# Altium project LedMatrix.PrjPCB (part 2 of 2)
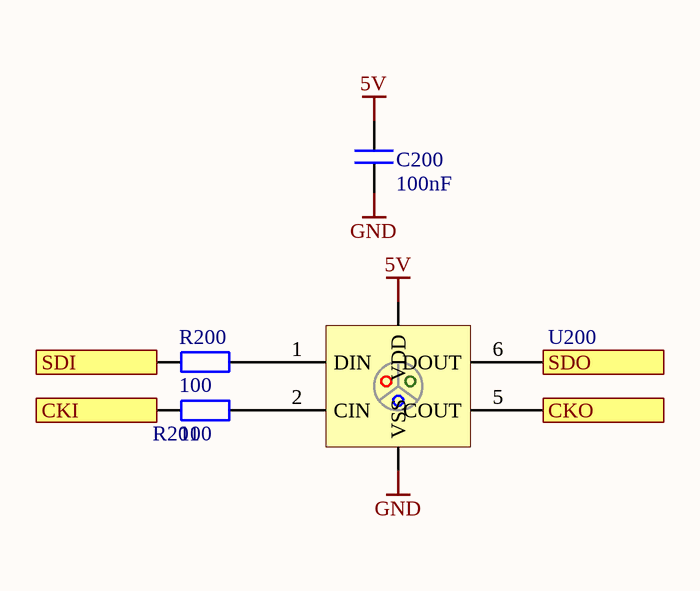
[diagram p3: LedMatrixPixel.SchDoc]

## Nets that join several sheets
5V: LedMatrixMain (5 pins), U_LedMatrixPixelArray/U_LedMatrixPixel (C200_U_LedMatrixPixel49.2 U200_U_LedMatrixPixel49.4), U_LedMatrixPixelArray/U_LedMatrixPixel (C200_U_LedMatrixPixel48.2 U200_U_LedMatrixPixel48.4), U_LedMatrixPixelArray/U_LedMatrixPixel (C200_U_LedMatrixPixel47.2 U200_U_LedMatrixPixel47.4), U_LedMatrixPixelArray/U_LedMatrixPixel (C200_U_LedMatrixPixel46.2 U200_U_LedMatrixPixel46.4), U_LedMatrixPixelArray/U_LedMatrixPixel (C200_U_LedMatrixPixel45.2 U200_U_LedMatrixPixel45.4), U_LedMatrixPixelArray/U_LedMatrixPixel (C200_U_LedMatrixPixel44.2 U200_U_LedMatrixPixel44.4), U_LedMatrixPixelArray/U_LedMatrixPixel (C200_U_LedMatrixPixel43.2 U200_U_LedMatrixPixel43.4), U_LedMatrixPixelArray/U_LedMatrixPixel (C200_U_LedMatrixPixel42.2 U200_U_LedMatrixPixel42.4), U_LedMatrixPixelArray/U_LedMatrixPixel (C200_U_LedMatrixPixel41.2 U200_U_LedMatrixPixel41.4), U_LedMatrixPixelArray/U_LedMatrixPixel (C200_U_LedMatrixPixel40.2 U200_U_LedMatrixPixel40.4), U_LedMatrixPixelArray/U_LedMatrixPixel (C200_U_LedMatrixPixel39.2 U200_U_LedMatrixPixel39.4), U_LedMatrixPixelArray/U_LedMatrixPixel (C200_U_LedMatrixPixel38.2 U200_U_LedMatrixPixel38.4), U_LedMatrixPixelArray/U_LedMatrixPixel (C200_U_LedMatrixPixel37.2 U200_U_LedMatrixPixel37.4), U_LedMatrixPixelArray/U_LedMatrixPixel (C200_U_LedMatrixPixel36.2 U200_U_LedMatrixPixel36.4), U_LedMatrixPixelArray/U_LedMatrixPixel (C200_U_LedMatrixPixel35.2 U200_U_LedMatrixPixel35.4), U_LedMatrixPixelArray/U_LedMatrixPixel (C200_U_LedMatrixPixel34.2 U200_U_LedMatrixPixel34.4), U_LedMatrixPixelArray/U_LedMatrixPixel (C200_U_LedMatrixPixel33.2 U200_U_LedMatrixPixel33.4), U_LedMatrixPixelArray/U_LedMatrixPixel (C200_U_LedMatrixPixel32.2 U200_U_LedMatrixPixel32.4), U_LedMatrixPixelArray/U_LedMatrixPixel (C200_U_LedMatrixPixel31.2 U200_U_LedMatrixPixel31.4), U_LedMatrixPixelArray/U_LedMatrixPixel (C200_U_LedMatrixPixel30.2 U200_U_LedMatrixPixel30.4), U_LedMatrixPixelArray/U_LedMatrixPixel (C200_U_LedMatrixPixel29.2 U200_U_LedMatrixPixel29.4), U_LedMatrixPixelArray/U_LedMatrixPixel (C200_U_LedMatrixPixel28.2 U200_U_LedMatrixPixel28.4), U_LedMatrixPixelArray/U_LedMatrixPixel (C200_U_LedMatrixPixel27.2 U200_U_LedMatrixPixel27.4), U_LedMatrixPixelArray/U_LedMatrixPixel (C200_U_LedMatrixPixel26.2 U200_U_LedMatrixPixel26.4), U_LedMatrixPixelArray/U_LedMatrixPixel (C200_U_LedMatrixPixel25.2 U200_U_LedMatrixPixel25.4), U_LedMatrixPixelArray/U_LedMatrixPixel (C200_U_LedMatrixPixel24.2 U200_U_LedMatrixPixel24.4), U_LedMatrixPixelArray/U_LedMatrixPixel (C200_U_LedMatrixPixel23.2 U200_U_LedMatrixPixel23.4), U_LedMatrixPixelArray/U_LedMatrixPixel (C200_U_LedMatrixPixel22.2 U200_U_LedMatrixPixel22.4), U_LedMatrixPixelArray/U_LedMatrixPixel (C200_U_LedMatrixPixel21.2 U200_U_LedMatrixPixel21.4), U_LedMatrixPixelArray/U_LedMatrixPixel (C200_U_LedMatrixPixel20.2 U200_U_LedMatrixPixel20.4), U_LedMatrixPixelArray/U_LedMatrixPixel (C200_U_LedMatrixPixel19.2 U200_U_LedMatrixPixel19.4), U_LedMatrixPixelArray/U_LedMatrixPixel (C200_U_LedMatrixPixel18.2 U200_U_LedMatrixPixel18.4), U_LedMatrixPixelArray/U_LedMatrixPixel (C200_U_LedMatrixPixel17.2 U200_U_LedMatrixPixel17.4), U_LedMatrixPixelArray/U_LedMatrixPixel (C200_U_LedMatrixPixel16.2 U200_U_LedMatrixPixel16.4), U_LedMatrixPixelArray/U_LedMatrixPixel (C200_U_LedMatrixPixel15.2 U200_U_LedMatrixPixel15.4), U_LedMatrixPixelArray/U_LedMatrixPixel (C200_U_LedMatrixPixel14.2 U200_U_LedMatrixPixel14.4), U_LedMatrixPixelArray/U_LedMatrixPixel (C200_U_LedMatrixPixel13.2 U200_U_LedMatrixPixel13.4), U_LedMatrixPixelArray/U_LedMatrixPixel (C200_U_LedMatrixPixel12.2 U200_U_LedMatrixPixel12.4), U_LedMatrixPixelArray/U_LedMatrixPixel (C200_U_LedMatrixPixel11.2 U200_U_LedMatrixPixel11.4), U_LedMatrixPixelArray/U_LedMatrixPixel (C200_U_LedMatrixPixel10.2 U200_U_LedMatrixPixel10.4), U_LedMatrixPixelArray/U_LedMatrixPixel (C200_U_LedMatrixPixel9.2 U200_U_LedMatrixPixel9.4), U_LedMatrixPixelArray/U_LedMatrixPixel (C200_U_LedMatrixPixel8.2 U200_U_LedMatrixPixel8.4), U_LedMatrixPixelArray/U_LedMatrixPixel (C200_U_LedMatrixPixel7.2 U200_U_LedMatrixPixel7.4), U_LedMatrixPixelArray/U_LedMatrixPixel (C200_U_LedMatrixPixel6.2 U200_U_LedMatrixPixel6.4), U_LedMatrixPixelArray/U_LedMatrixPixel (C200_U_LedMatrixPixel5.2 U200_U_LedMatrixPixel5.4), U_LedMatrixPixelArray/U_LedMatrixPixel (C200_U_LedMatrixPixel4.2 U200_U_LedMatrixPixel4.4), U_LedMatrixPixelArray/U_LedMatrixPixel (C200_U_LedMatrixPixel3.2 U200_U_LedMatrixPixel3.4), U_LedMatrixPixelArray/U_LedMatrixPixel (C200_U_LedMatrixPixel2.2 U200_U_LedMatrixPixel2.4), U_LedMatrixPixelArray/U_LedMatrixPixel (C200_U_LedMatrixPixel1.2 U200_U_LedMatrixPixel1.4)
GND: LedMatrixMain (14 pins), U_LedMatrixPixelArray/U_LedMatrixPixel (C200_U_LedMatrixPixel49.1 U200_U_LedMatrixPixel49.3), U_LedMatrixPixelArray/U_LedMatrixPixel (C200_U_LedMatrixPixel48.1 U200_U_LedMatrixPixel48.3), U_LedMatrixPixelArray/U_LedMatrixPixel (C200_U_LedMatrixPixel47.1 U200_U_LedMatrixPixel47.3), U_LedMatrixPixelArray/U_LedMatrixPixel (C200_U_LedMatrixPixel46.1 U200_U_LedMatrixPixel46.3), U_LedMatrixPixelArray/U_LedMatrixPixel (C200_U_LedMatrixPixel45.1 U200_U_LedMatrixPixel45.3), U_LedMatrixPixelArray/U_LedMatrixPixel (C200_U_LedMatrixPixel44.1 U200_U_LedMatrixPixel44.3), U_LedMatrixPixelArray/U_LedMatrixPixel (C200_U_LedMatrixPixel43.1 U200_U_LedMatrixPixel43.3), U_LedMatrixPixelArray/U_LedMatrixPixel (C200_U_LedMatrixPixel42.1 U200_U_LedMatrixPixel42.3), U_LedMatrixPixelArray/U_LedMatrixPixel (C200_U_LedMatrixPixel41.1 U200_U_LedMatrixPixel41.3), U_LedMatrixPixelArray/U_LedMatrixPixel (C200_U_LedMatrixPixel40.1 U200_U_LedMatrixPixel40.3), U_LedMatrixPixelArray/U_LedMatrixPixel (C200_U_LedMatrixPixel39.1 U200_U_LedMatrixPixel39.3), U_LedMatrixPixelArray/U_LedMatrixPixel (C200_U_LedMatrixPixel38.1 U200_U_LedMatrixPixel38.3), U_LedMatrixPixelArray/U_LedMatrixPixel (C200_U_LedMatrixPixel37.1 U200_U_LedMatrixPixel37.3), U_LedMatrixPixelArray/U_LedMatrixPixel (C200_U_LedMatrixPixel36.1 U200_U_LedMatrixPixel36.3), U_LedMatrixPixelArray/U_LedMatrixPixel (C200_U_LedMatrixPixel35.1 U200_U_LedMatrixPixel35.3), U_LedMatrixPixelArray/U_LedMatrixPixel (C200_U_LedMatrixPixel34.1 U200_U_LedMatrixPixel34.3), U_LedMatrixPixelArray/U_LedMatrixPixel (C200_U_LedMatrixPixel33.1 U200_U_LedMatrixPixel33.3), U_LedMatrixPixelArray/U_LedMatrixPixel (C200_U_LedMatrixPixel32.1 U200_U_LedMatrixPixel32.3), U_LedMatrixPixelArray/U_LedMatrixPixel (C200_U_LedMatrixPixel31.1 U200_U_LedMatrixPixel31.3), U_LedMatrixPixelArray/U_LedMatrixPixel (C200_U_LedMatrixPixel30.1 U200_U_LedMatrixPixel30.3), U_LedMatrixPixelArray/U_LedMatrixPixel (C200_U_LedMatrixPixel29.1 U200_U_LedMatrixPixel29.3), U_LedMatrixPixelArray/U_LedMatrixPixel (C200_U_LedMatrixPixel28.1 U200_U_LedMatrixPixel28.3), U_LedMatrixPixelArray/U_LedMatrixPixel (C200_U_LedMatrixPixel27.1 U200_U_LedMatrixPixel27.3), U_LedMatrixPixelArray/U_LedMatrixPixel (C200_U_LedMatrixPixel26.1 U200_U_LedMatrixPixel26.3), U_LedMatrixPixelArray/U_LedMatrixPixel (C200_U_LedMatrixPixel25.1 U200_U_LedMatrixPixel25.3), U_LedMatrixPixelArray/U_LedMatrixPixel (C200_U_LedMatrixPixel24.1 U200_U_LedMatrixPixel24.3), U_LedMatrixPixelArray/U_LedMatrixPixel (C200_U_LedMatrixPixel23.1 U200_U_LedMatrixPixel23.3), U_LedMatrixPixelArray/U_LedMatrixPixel (C200_U_LedMatrixPixel22.1 U200_U_LedMatrixPixel22.3), U_LedMatrixPixelArray/U_LedMatrixPixel (C200_U_LedMatrixPixel21.1 U200_U_LedMatrixPixel21.3), U_LedMatrixPixelArray/U_LedMatrixPixel (C200_U_LedMatrixPixel20.1 U200_U_LedMatrixPixel20.3), U_LedMatrixPixelArray/U_LedMatrixPixel (C200_U_LedMatrixPixel19.1 U200_U_LedMatrixPixel19.3), U_LedMatrixPixelArray/U_LedMatrixPixel (C200_U_LedMatrixPixel18.1 U200_U_LedMatrixPixel18.3), U_LedMatrixPixelArray/U_LedMatrixPixel (C200_U_LedMatrixPixel17.1 U200_U_LedMatrixPixel17.3), U_LedMatrixPixelArray/U_LedMatrixPixel (C200_U_LedMatrixPixel16.1 U200_U_LedMatrixPixel16.3), U_LedMatrixPixelArray/U_LedMatrixPixel (C200_U_LedMatrixPixel15.1 U200_U_LedMatrixPixel15.3), U_LedMatrixPixelArray/U_LedMatrixPixel (C200_U_LedMatrixPixel14.1 U200_U_LedMatrixPixel14.3), U_LedMatrixPixelArray/U_LedMatrixPixel (C200_U_LedMatrixPixel13.1 U200_U_LedMatrixPixel13.3), U_LedMatrixPixelArray/U_LedMatrixPixel (C200_U_LedMatrixPixel12.1 U200_U_LedMatrixPixel12.3), U_LedMatrixPixelArray/U_LedMatrixPixel (C200_U_LedMatrixPixel11.1 U200_U_LedMatrixPixel11.3), U_LedMatrixPixelArray/U_LedMatrixPixel (C200_U_LedMatrixPixel10.1 U200_U_LedMatrixPixel10.3), U_LedMatrixPixelArray/U_LedMatrixPixel (C200_U_LedMatrixPixel9.1 U200_U_LedMatrixPixel9.3), U_LedMatrixPixelArray/U_LedMatrixPixel (C200_U_LedMatrixPixel8.1 U200_U_LedMatrixPixel8.3), U_LedMatrixPixelArray/U_LedMatrixPixel (C200_U_LedMatrixPixel7.1 U200_U_LedMatrixPixel7.3), U_LedMatrixPixelArray/U_LedMatrixPixel (C200_U_LedMatrixPixel6.1 U200_U_LedMatrixPixel6.3), U_LedMatrixPixelArray/U_LedMatrixPixel (C200_U_LedMatrixPixel5.1 U200_U_LedMatrixPixel5.3), U_LedMatrixPixelArray/U_LedMatrixPixel (C200_U_LedMatrixPixel4.1 U200_U_LedMatrixPixel4.3), U_LedMatrixPixelArray/U_LedMatrixPixel (C200_U_LedMatrixPixel3.1 U200_U_LedMatrixPixel3.3), U_LedMatrixPixelArray/U_LedMatrixPixel (C200_U_LedMatrixPixel2.1 U200_U_LedMatrixPixel2.3), U_LedMatrixPixelArray/U_LedMatrixPixel (C200_U_LedMatrixPixel1.1 U200_U_LedMatrixPixel1.3)
CKO8: U_LedMatrixPixelArray/U_LedMatrixPixel (R201_U_LedMatrixPixel44.1), U_LedMatrixPixelArray/U_LedMatrixPixel (U200_U_LedMatrixPixel1.5)
CKO16: U_LedMatrixPixelArray/U_LedMatrixPixel (R201_U_LedMatrixPixel45.1), U_LedMatrixPixelArray/U_LedMatrixPixel (U200_U_LedMatrixPixel2.5)
CKO24: U_LedMatrixPixelArray/U_LedMatrixPixel (R201_U_LedMatrixPixel46.1), U_LedMatrixPixelArray/U_LedMatrixPixel (U200_U_LedMatrixPixel3.5)
CKO32: U_LedMatrixPixelArray/U_LedMatrixPixel (R201_U_LedMatrixPixel47.1), U_LedMatrixPixelArray/U_LedMatrixPixel (U200_U_LedMatrixPixel4.5)
CKO40: U_LedMatrixPixelArray/U_LedMatrixPixel (R201_U_LedMatrixPixel48.1), U_LedMatrixPixelArray/U_LedMatrixPixel (U200_U_LedMatrixPixel5.5)
CKO48: U_LedMatrixPixelArray/U_LedMatrixPixel (R201_U_LedMatrixPixel49.1), U_LedMatrixPixelArray/U_LedMatrixPixel (U200_U_LedMatrixPixel6.5)
NetR200_U_LedMatrixPixel1_1: U_LedMatrixPixelArray/U_LedMatrixPixel (U200_U_LedMatrixPixel8.6), U_LedMatrixPixelArray/U_LedMatrixPixel (R200_U_LedMatrixPixel1.1)
NetR200_U_LedMatrixPixel2_1: U_LedMatrixPixelArray/U_LedMatrixPixel (U200_U_LedMatrixPixel9.6), U_LedMatrixPixelArray/U_LedMatrixPixel (R200_U_LedMatrixPixel2.1)
NetR200_U_LedMatrixPixel3_1: U_LedMatrixPixelArray/U_LedMatrixPixel (U200_U_LedMatrixPixel10.6), U_LedMatrixPixelArray/U_LedMatrixPixel (R200_U_LedMatrixPixel3.1)
NetR200_U_LedMatrixPixel4_1: U_LedMatrixPixelArray/U_LedMatrixPixel (U200_U_LedMatrixPixel11.6), U_LedMatrixPixelArray/U_LedMatrixPixel (R200_U_LedMatrixPixel4.1)
NetR200_U_LedMatrixPixel5_1: U_LedMatrixPixelArray/U_LedMatrixPixel (U200_U_LedMatrixPixel12.6), U_LedMatrixPixelArray/U_LedMatrixPixel (R200_U_LedMatrixPixel5.1)
NetR200_U_LedMatrixPixel6_1: U_LedMatrixPixelArray/U_LedMatrixPixel (U200_U_LedMatrixPixel13.6), U_LedMatrixPixelArray/U_LedMatrixPixel (R200_U_LedMatrixPixel6.1)
NetR200_U_LedMatrixPixel7_1: U_LedMatrixPixelArray/U_LedMatrixPixel (U200_U_LedMatrixPixel14.6), U_LedMatrixPixelArray/U_LedMatrixPixel (R200_U_LedMatrixPixel7.1)
NetR200_U_LedMatrixPixel8_1: U_LedMatrixPixelArray/U_LedMatrixPixel (U200_U_LedMatrixPixel15.6), U_LedMatrixPixelArray/U_LedMatrixPixel (R200_U_LedMatrixPixel8.1)
NetR200_U_LedMatrixPixel9_1: U_LedMatrixPixelArray/U_LedMatrixPixel (U200_U_LedMatrixPixel16.6), U_LedMatrixPixelArray/U_LedMatrixPixel (R200_U_LedMatrixPixel9.1)
NetR200_U_LedMatrixPixel10_1: U_LedMatrixPixelArray/U_LedMatrixPixel (U200_U_LedMatrixPixel17.6), U_LedMatrixPixelArray/U_LedMatrixPixel (R200_U_LedMatrixPixel10.1)
NetR200_U_LedMatrixPixel11_1: U_LedMatrixPixelArray/U_LedMatrixPixel (U200_U_LedMatrixPixel18.6), U_LedMatrixPixelArray/U_LedMatrixPixel (R200_U_LedMatrixPixel11.1)
NetR200_U_LedMatrixPixel12_1: U_LedMatrixPixelArray/U_LedMatrixPixel (U200_U_LedMatrixPixel19.6), U_LedMatrixPixelArray/U_LedMatrixPixel (R200_U_LedMatrixPixel12.1)
NetR200_U_LedMatrixPixel13_1: U_LedMatrixPixelArray/U_LedMatrixPixel (U200_U_LedMatrixPixel20.6), U_LedMatrixPixelArray/U_LedMatrixPixel (R200_U_LedMatrixPixel13.1)
NetR200_U_LedMatrixPixel14_1: U_LedMatrixPixelArray/U_LedMatrixPixel (U200_U_LedMatrixPixel21.6), U_LedMatrixPixelArray/U_LedMatrixPixel (R200_U_LedMatrixPixel14.1)
NetR200_U_LedMatrixPixel15_1: U_LedMatrixPixelArray/U_LedMatrixPixel (U200_U_LedMatrixPixel22.6), U_LedMatrixPixelArray/U_LedMatrixPixel (R200_U_LedMatrixPixel15.1)
NetR200_U_LedMatrixPixel16_1: U_LedMatrixPixelArray/U_LedMatrixPixel (U200_U_LedMatrixPixel23.6), U_LedMatrixPixelArray/U_LedMatrixPixel (R200_U_LedMatrixPixel16.1)
NetR200_U_LedMatrixPixel17_1: U_LedMatrixPixelArray/U_LedMatrixPixel (U200_U_LedMatrixPixel24.6), U_LedMatrixPixelArray/U_LedMatrixPixel (R200_U_LedMatrixPixel17.1)
NetR200_U_LedMatrixPixel18_1: U_LedMatrixPixelArray/U_LedMatrixPixel (U200_U_LedMatrixPixel25.6), U_LedMatrixPixelArray/U_LedMatrixPixel (R200_U_LedMatrixPixel18.1)
NetR200_U_LedMatrixPixel19_1: U_LedMatrixPixelArray/U_LedMatrixPixel (U200_U_LedMatrixPixel26.6), U_LedMatrixPixelArray/U_LedMatrixPixel (R200_U_LedMatrixPixel19.1)
NetR200_U_LedMatrixPixel20_1: U_LedMatrixPixelArray/U_LedMatrixPixel (U200_U_LedMatrixPixel27.6), U_LedMatrixPixelArray/U_LedMatrixPixel (R200_U_LedMatrixPixel20.1)
NetR200_U_LedMatrixPixel21_1: U_LedMatrixPixelArray/U_LedMatrixPixel (U200_U_LedMatrixPixel28.6), U_LedMatrixPixelArray/U_LedMatrixPixel (R200_U_LedMatrixPixel21.1)
NetR200_U_LedMatrixPixel22_1: U_LedMatrixPixelArray/U_LedMatrixPixel (U200_U_LedMatrixPixel29.6), U_LedMatrixPixelArray/U_LedMatrixPixel (R200_U_LedMatrixPixel22.1)
NetR200_U_LedMatrixPixel23_1: U_LedMatrixPixelArray/U_LedMatrixPixel (U200_U_LedMatrixPixel30.6), U_LedMatrixPixelArray/U_LedMatrixPixel (R200_U_LedMatrixPixel23.1)
NetR200_U_LedMatrixPixel24_1: U_LedMatrixPixelArray/U_LedMatrixPixel (U200_U_LedMatrixPixel31.6), U_LedMatrixPixelArray/U_LedMatrixPixel (R200_U_LedMatrixPixel24.1)
NetR200_U_LedMatrixPixel25_1: U_LedMatrixPixelArray/U_LedMatrixPixel (U200_U_LedMatrixPixel32.6), U_LedMatrixPixelArray/U_LedMatrixPixel (R200_U_LedMatrixPixel25.1)
NetR200_U_LedMatrixPixel26_1: U_LedMatrixPixelArray/U_LedMatrixPixel (U200_U_LedMatrixPixel33.6), U_LedMatrixPixelArray/U_LedMatrixPixel (R200_U_LedMatrixPixel26.1)
NetR200_U_LedMatrixPixel27_1: U_LedMatrixPixelArray/U_LedMatrixPixel (U200_U_LedMatrixPixel34.6), U_LedMatrixPixelArray/U_LedMatrixPixel (R200_U_LedMatrixPixel27.1)
NetR200_U_LedMatrixPixel28_1: U_LedMatrixPixelArray/U_LedMatrixPixel (U200_U_LedMatrixPixel35.6), U_LedMatrixPixelArray/U_LedMatrixPixel (R200_U_LedMatrixPixel28.1)
NetR200_U_LedMatrixPixel29_1: U_LedMatrixPixelArray/U_LedMatrixPixel (U200_U_LedMatrixPixel36.6), U_LedMatrixPixelArray/U_LedMatrixPixel (R200_U_LedMatrixPixel29.1)
NetR200_U_LedMatrixPixel30_1: U_LedMatrixPixelArray/U_LedMatrixPixel (U200_U_LedMatrixPixel37.6), U_LedMatrixPixelArray/U_LedMatrixPixel (R200_U_LedMatrixPixel30.1)
NetR200_U_LedMatrixPixel31_1: U_LedMatrixPixelArray/U_LedMatrixPixel (U200_U_LedMatrixPixel38.6), U_LedMatrixPixelArray/U_LedMatrixPixel (R200_U_LedMatrixPixel31.1)
NetR200_U_LedMatrixPixel32_1: U_LedMatrixPixelArray/U_LedMatrixPixel (U200_U_LedMatrixPixel39.6), U_LedMatrixPixelArray/U_LedMatrixPixel (R200_U_LedMatrixPixel32.1)
NetR200_U_LedMatrixPixel33_1: U_LedMatrixPixelArray/U_LedMatrixPixel (U200_U_LedMatrixPixel40.6), U_LedMatrixPixelArray/U_LedMatrixPixel (R200_U_LedMatrixPixel33.1)
NetR200_U_LedMatrixPixel34_1: U_LedMatrixPixelArray/U_LedMatrixPixel (U200_U_LedMatrixPixel41.6), U_LedMatrixPixelArray/U_LedMatrixPixel (R200_U_LedMatrixPixel34.1)
NetR200_U_LedMatrixPixel35_1: U_LedMatrixPixelArray/U_LedMatrixPixel (U200_U_LedMatrixPixel42.6), U_LedMatrixPixelArray/U_LedMatrixPixel (R200_U_LedMatrixPixel35.1)
NetR200_U_LedMatrixPixel36_1: U_LedMatrixPixelArray/U_LedMatrixPixel (U200_U_LedMatrixPixel43.6), U_LedMatrixPixelArray/U_LedMatrixPixel (R200_U_LedMatrixPixel36.1)
NetR200_U_LedMatrixPixel37_1: U_LedMatrixPixelArray/U_LedMatrixPixel (U200_U_LedMatrixPixel44.6), U_LedMatrixPixelArray/U_LedMatrixPixel (R200_U_LedMatrixPixel37.1)
NetR200_U_LedMatrixPixel38_1: U_LedMatrixPixelArray/U_LedMatrixPixel (U200_U_LedMatrixPixel45.6), U_LedMatrixPixelArray/U_LedMatrixPixel (R200_U_LedMatrixPixel38.1)
NetR200_U_LedMatrixPixel39_1: U_LedMatrixPixelArray/U_LedMatrixPixel (U200_U_LedMatrixPixel46.6), U_LedMatrixPixelArray/U_LedMatrixPixel (R200_U_LedMatrixPixel39.1)
NetR200_U_LedMatrixPixel40_1: U_LedMatrixPixelArray/U_LedMatrixPixel (U200_U_LedMatrixPixel47.6), U_LedMatrixPixelArray/U_LedMatrixPixel (R200_U_LedMatrixPixel40.1)
NetR200_U_LedMatrixPixel41_1: U_LedMatrixPixelArray/U_LedMatrixPixel (U200_U_LedMatrixPixel48.6), U_LedMatrixPixelArray/U_LedMatrixPixel (R200_U_LedMatrixPixel41.1)
NetR200_U_LedMatrixPixel42_1: U_LedMatrixPixelArray/U_LedMatrixPixel (U200_U_LedMatrixPixel49.6), U_LedMatrixPixelArray/U_LedMatrixPixel (R200_U_LedMatrixPixel42.1)
NetR200_U_LedMatrixPixel43_1: LedMatrixMain (U101.4), U_LedMatrixPixelArray/U_LedMatrixPixel (R200_U_LedMatrixPixel43.1)
NetR201_U_LedMatrixPixel1_1: U_LedMatrixPixelArray/U_LedMatrixPixel (U200_U_LedMatrixPixel8.5), U_LedMatrixPixelArray/U_LedMatrixPixel (R201_U_LedMatrixPixel1.1)
NetR201_U_LedMatrixPixel2_1: U_LedMatrixPixelArray/U_LedMatrixPixel (U200_U_LedMatrixPixel9.5), U_LedMatrixPixelArray/U_LedMatrixPixel (R201_U_LedMatrixPixel2.1)
NetR201_U_LedMatrixPixel3_1: U_LedMatrixPixelArray/U_LedMatrixPixel (U200_U_LedMatrixPixel10.5), U_LedMatrixPixelArray/U_LedMatrixPixel (R201_U_LedMatrixPixel3.1)
NetR201_U_LedMatrixPixel4_1: U_LedMatrixPixelArray/U_LedMatrixPixel (U200_U_LedMatrixPixel11.5), U_LedMatrixPixelArray/U_LedMatrixPixel (R201_U_LedMatrixPixel4.1)
NetR201_U_LedMatrixPixel5_1: U_LedMatrixPixelArray/U_LedMatrixPixel (U200_U_LedMatrixPixel12.5), U_LedMatrixPixelArray/U_LedMatrixPixel (R201_U_LedMatrixPixel5.1)
NetR201_U_LedMatrixPixel6_1: U_LedMatrixPixelArray/U_LedMatrixPixel (U200_U_LedMatrixPixel13.5), U_LedMatrixPixelArray/U_LedMatrixPixel (R201_U_LedMatrixPixel6.1)
NetR201_U_LedMatrixPixel7_1: U_LedMatrixPixelArray/U_LedMatrixPixel (U200_U_LedMatrixPixel14.5), U_LedMatrixPixelArray/U_LedMatrixPixel (R201_U_LedMatrixPixel7.1)
NetR201_U_LedMatrixPixel8_1: U_LedMatrixPixelArray/U_LedMatrixPixel (U200_U_LedMatrixPixel15.5), U_LedMatrixPixelArray/U_LedMatrixPixel (R201_U_LedMatrixPixel8.1)
NetR201_U_LedMatrixPixel9_1: U_LedMatrixPixelArray/U_LedMatrixPixel (U200_U_LedMatrixPixel16.5), U_LedMatrixPixelArray/U_LedMatrixPixel (R201_U_LedMatrixPixel9.1)
NetR201_U_LedMatrixPixel10_1: U_LedMatrixPixelArray/U_LedMatrixPixel (U200_U_LedMatrixPixel17.5), U_LedMatrixPixelArray/U_LedMatrixPixel (R201_U_LedMatrixPixel10.1)
NetR201_U_LedMatrixPixel11_1: U_LedMatrixPixelArray/U_LedMatrixPixel (U200_U_LedMatrixPixel18.5), U_LedMatrixPixelArray/U_LedMatrixPixel (R201_U_LedMatrixPixel11.1)
NetR201_U_LedMatrixPixel12_1: U_LedMatrixPixelArray/U_LedMatrixPixel (U200_U_LedMatrixPixel19.5), U_LedMatrixPixelArray/U_LedMatrixPixel (R201_U_LedMatrixPixel12.1)
NetR201_U_LedMatrixPixel13_1: U_LedMatrixPixelArray/U_LedMatrixPixel (U200_U_LedMatrixPixel20.5), U_LedMatrixPixelArray/U_LedMatrixPixel (R201_U_LedMatrixPixel13.1)
NetR201_U_LedMatrixPixel14_1: U_LedMatrixPixelArray/U_LedMatrixPixel (U200_U_LedMatrixPixel21.5), U_LedMatrixPixelArray/U_LedMatrixPixel (R201_U_LedMatrixPixel14.1)
NetR201_U_LedMatrixPixel15_1: U_LedMatrixPixelArray/U_LedMatrixPixel (U200_U_LedMatrixPixel22.5), U_LedMatrixPixelArray/U_LedMatrixPixel (R201_U_LedMatrixPixel15.1)
NetR201_U_LedMatrixPixel16_1: U_LedMatrixPixelArray/U_LedMatrixPixel (U200_U_LedMatrixPixel23.5), U_LedMatrixPixelArray/U_LedMatrixPixel (R201_U_LedMatrixPixel16.1)
NetR201_U_LedMatrixPixel17_1: U_LedMatrixPixelArray/U_LedMatrixPixel (U200_U_LedMatrixPixel24.5), U_LedMatrixPixelArray/U_LedMatrixPixel (R201_U_LedMatrixPixel17.1)
NetR201_U_LedMatrixPixel18_1: U_LedMatrixPixelArray/U_LedMatrixPixel (U200_U_LedMatrixPixel25.5), U_LedMatrixPixelArray/U_LedMatrixPixel (R201_U_LedMatrixPixel18.1)
NetR201_U_LedMatrixPixel19_1: U_LedMatrixPixelArray/U_LedMatrixPixel (U200_U_LedMatrixPixel26.5), U_LedMatrixPixelArray/U_LedMatrixPixel (R201_U_LedMatrixPixel19.1)
NetR201_U_LedMatrixPixel20_1: U_LedMatrixPixelArray/U_LedMatrixPixel (U200_U_LedMatrixPixel27.5), U_LedMatrixPixelArray/U_LedMatrixPixel (R201_U_LedMatrixPixel20.1)
NetR201_U_LedMatrixPixel21_1: U_LedMatrixPixelArray/U_LedMatrixPixel (U200_U_LedMatrixPixel28.5), U_LedMatrixPixelArray/U_LedMatrixPixel (R201_U_LedMatrixPixel21.1)
NetR201_U_LedMatrixPixel22_1: U_LedMatrixPixelArray/U_LedMatrixPixel (U200_U_LedMatrixPixel29.5), U_LedMatrixPixelArray/U_LedMatrixPixel (R201_U_LedMatrixPixel22.1)
NetR201_U_LedMatrixPixel23_1: U_LedMatrixPixelArray/U_LedMatrixPixel (U200_U_LedMatrixPixel30.5), U_LedMatrixPixelArray/U_LedMatrixPixel (R201_U_LedMatrixPixel23.1)
NetR201_U_LedMatrixPixel24_1: U_LedMatrixPixelArray/U_LedMatrixPixel (U200_U_LedMatrixPixel31.5), U_LedMatrixPixelArray/U_LedMatrixPixel (R201_U_LedMatrixPixel24.1)
NetR201_U_LedMatrixPixel25_1: U_LedMatrixPixelArray/U_LedMatrixPixel (U200_U_LedMatrixPixel32.5), U_LedMatrixPixelArray/U_LedMatrixPixel (R201_U_LedMatrixPixel25.1)
NetR201_U_LedMatrixPixel26_1: U_LedMatrixPixelArray/U_LedMatrixPixel (U200_U_LedMatrixPixel33.5), U_LedMatrixPixelArray/U_LedMatrixPixel (R201_U_LedMatrixPixel26.1)
NetR201_U_LedMatrixPixel27_1: U_LedMatrixPixelArray/U_LedMatrixPixel (U200_U_LedMatrixPixel34.5), U_LedMatrixPixelArray/U_LedMatrixPixel (R201_U_LedMatrixPixel27.1)
NetR201_U_LedMatrixPixel28_1: U_LedMatrixPixelArray/U_LedMatrixPixel (U200_U_LedMatrixPixel35.5), U_LedMatrixPixelArray/U_LedMatrixPixel (R201_U_LedMatrixPixel28.1)
NetR201_U_LedMatrixPixel29_1: U_LedMatrixPixelArray/U_LedMatrixPixel (U200_U_LedMatrixPixel36.5), U_LedMatrixPixelArray/U_LedMatrixPixel (R201_U_LedMatrixPixel29.1)
NetR201_U_LedMatrixPixel30_1: U_LedMatrixPixelArray/U_LedMatrixPixel (U200_U_LedMatrixPixel37.5), U_LedMatrixPixelArray/U_LedMatrixPixel (R201_U_LedMatrixPixel30.1)
NetR201_U_LedMatrixPixel31_1: U_LedMatrixPixelArray/U_LedMatrixPixel (U200_U_LedMatrixPixel38.5), U_LedMatrixPixelArray/U_LedMatrixPixel (R201_U_LedMatrixPixel31.1)
NetR201_U_LedMatrixPixel32_1: U_LedMatrixPixelArray/U_LedMatrixPixel (U200_U_LedMatrixPixel39.5), U_LedMatrixPixelArray/U_LedMatrixPixel (R201_U_LedMatrixPixel32.1)
NetR201_U_LedMatrixPixel33_1: U_LedMatrixPixelArray/U_LedMatrixPixel (U200_U_LedMatrixPixel40.5), U_LedMatrixPixelArray/U_LedMatrixPixel (R201_U_LedMatrixPixel33.1)
NetR201_U_LedMatrixPixel34_1: U_LedMatrixPixelArray/U_LedMatrixPixel (U200_U_LedMatrixPixel41.5), U_LedMatrixPixelArray/U_LedMatrixPixel (R201_U_LedMatrixPixel34.1)
NetR201_U_LedMatrixPixel35_1: U_LedMatrixPixelArray/U_LedMatrixPixel (U200_U_LedMatrixPixel42.5), U_LedMatrixPixelArray/U_LedMatrixPixel (R201_U_LedMatrixPixel35.1)
NetR201_U_LedMatrixPixel36_1: U_LedMatrixPixelArray/U_LedMatrixPixel (U200_U_LedMatrixPixel43.5), U_LedMatrixPixelArray/U_LedMatrixPixel (R201_U_LedMatrixPixel36.1)
NetR201_U_LedMatrixPixel37_1: U_LedMatrixPixelArray/U_LedMatrixPixel (U200_U_LedMatrixPixel44.5), U_LedMatrixPixelArray/U_LedMatrixPixel (R201_U_LedMatrixPixel37.1)
NetR201_U_LedMatrixPixel38_1: U_LedMatrixPixelArray/U_LedMatrixPixel (U200_U_LedMatrixPixel45.5), U_LedMatrixPixelArray/U_LedMatrixPixel (R201_U_LedMatrixPixel38.1)
NetR201_U_LedMatrixPixel39_1: U_LedMatrixPixelArray/U_LedMatrixPixel (U200_U_LedMatrixPixel46.5), U_LedMatrixPixelArray/U_LedMatrixPixel (R201_U_LedMatrixPixel39.1)
NetR201_U_LedMatrixPixel40_1: U_LedMatrixPixelArray/U_LedMatrixPixel (U200_U_LedMatrixPixel47.5), U_LedMatrixPixelArray/U_LedMatrixPixel (R201_U_LedMatrixPixel40.1)
NetR201_U_LedMatrixPixel41_1: U_LedMatrixPixelArray/U_LedMatrixPixel (U200_U_LedMatrixPixel48.5), U_LedMatrixPixelArray/U_LedMatrixPixel (R201_U_LedMatrixPixel41.1)
NetR201_U_LedMatrixPixel42_1: U_LedMatrixPixelArray/U_LedMatrixPixel (U200_U_LedMatrixPixel49.5), U_LedMatrixPixelArray/U_LedMatrixPixel (R201_U_LedMatrixPixel42.1)
NetR201_U_LedMatrixPixel43_1: LedMatrixMain (U102.4), U_LedMatrixPixelArray/U_LedMatrixPixel (R201_U_LedMatrixPixel43.1)
SDO8: U_LedMatrixPixelArray/U_LedMatrixPixel (R200_U_LedMatrixPixel44.1), U_LedMatrixPixelArray/U_LedMatrixPixel (U200_U_LedMatrixPixel1.6)
SDO16: U_LedMatrixPixelArray/U_LedMatrixPixel (R200_U_LedMatrixPixel45.1), U_LedMatrixPixelArray/U_LedMatrixPixel (U200_U_LedMatrixPixel2.6)
SDO24: U_LedMatrixPixelArray/U_LedMatrixPixel (R200_U_LedMatrixPixel46.1), U_LedMatrixPixelArray/U_LedMatrixPixel (U200_U_LedMatrixPixel3.6)
SDO32: U_LedMatrixPixelArray/U_LedMatrixPixel (R200_U_LedMatrixPixel47.1), U_LedMatrixPixelArray/U_LedMatrixPixel (U200_U_LedMatrixPixel4.6)
SDO40: U_LedMatrixPixelArray/U_LedMatrixPixel (R200_U_LedMatrixPixel48.1), U_LedMatrixPixelArray/U_LedMatrixPixel (U200_U_LedMatrixPixel5.6)
SDO48: U_LedMatrixPixelArray/U_LedMatrixPixel (R200_U_LedMatrixPixel49.1), U_LedMatrixPixelArray/U_LedMatrixPixel (U200_U_LedMatrixPixel6.6)